# EAGLE design adcsd_shield (EAGLE 7.3.0)
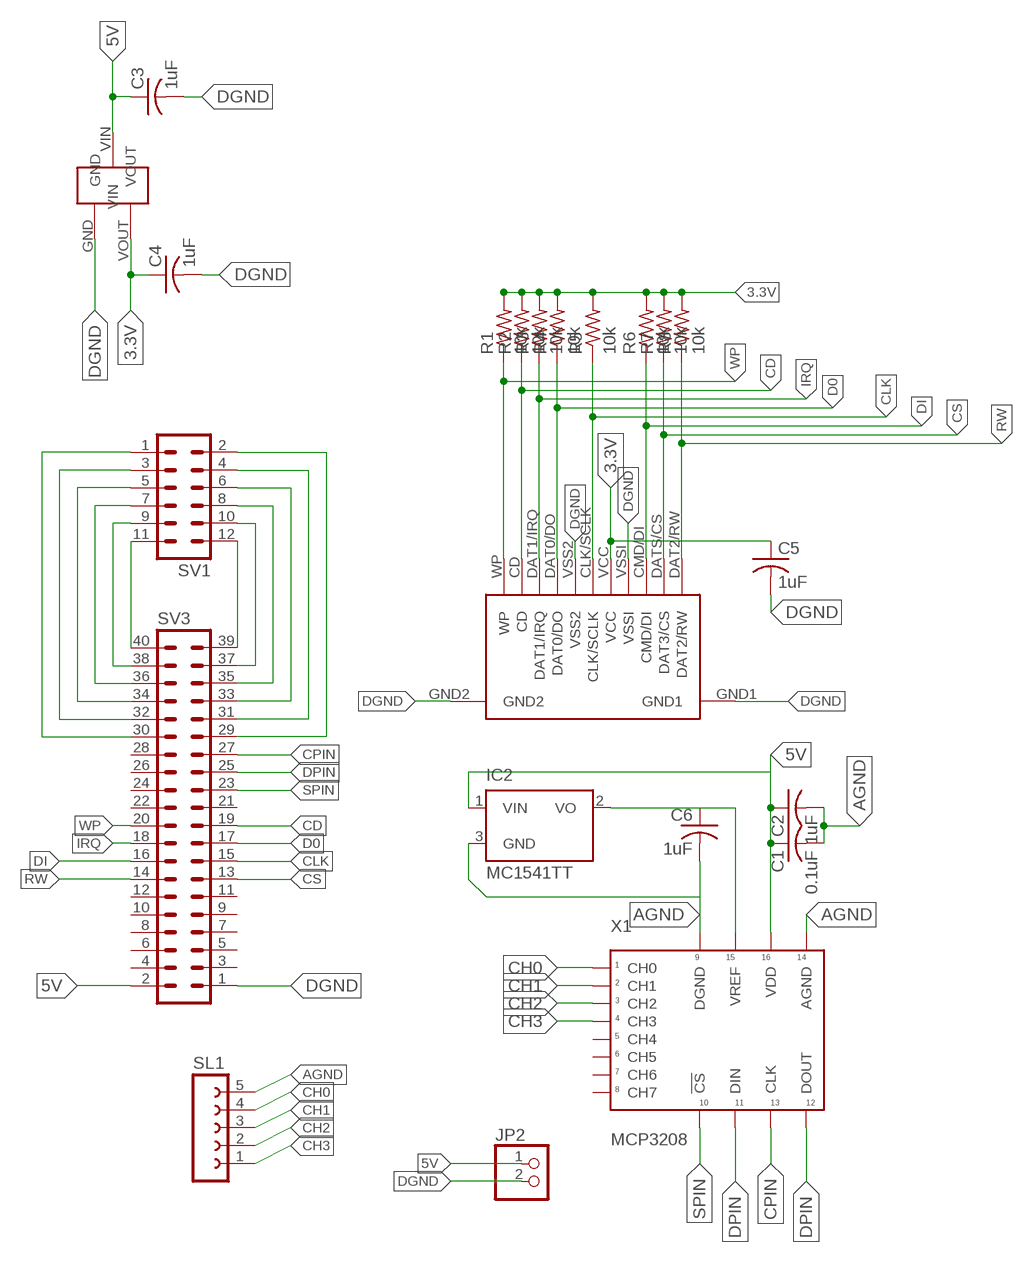
[diagram p0: schematic, sheet 1]

## Parts
C1  0.1uF  C-USC0402  [C0402]
C2  1uF  C-USC0402  [C0402]
C3  1uF  C-USC0402  [C0402]
C4  1uF  C-USC0402  [C0402]
C5  1uF  C-USC0402  [C0402]
C6  1uF  C-USC0402  [C0402]
IC2  MC1541TT  [SOT23]
JP2  PINHD-1X2  [1X02]
R1  10k  R-US_R0603  [R0603]
R2  10k  R-US_R0603  [R0603]
R3  10k  R-US_R0603  [R0603]
R4  10k  R-US_R0603  [R0603]
R5  10k  R-US_R0603  [R0603]
R6  10k  R-US_R0603  [R0603]
R7  10k  R-US_R0603  [R0603]
R8  10k  R-US_R0603  [R0603]
SL1  FE05-1  [FE05-1]
SV1  MA06-2  [MA06-2]
SV3  MA20-2  [MA20-2]
U$1  SD_1.0  [SD_1.0]
U$2  MCP1700T  [SOT23]
X1  MCP3208  21298EDIP  [DIP16]

## Nets
3.3V: C4.1 C5.1 R1.2 R2.2 R3.2 R4.2 R5.2 R6.2 R7.2 R8.2 U$1.VCC U$2.VOUT
5V: C1.1 C2.1 C3.1 IC2.1(VIN) JP2.1 SV3.2 U$2.VIN X1.P$16(VDD)
AGND: C1.2 C2.2 C6.2 IC2.3(GND) SL1.5 X1.P$9(DGND) X1.P$14(AGND)
CD: R2.1 SV3.19 U$1.CD
CH0: SL1.4 X1.P$1(CH0)
CH1: SL1.3 X1.P$2(CH1)
CH2: SL1.2 X1.P$3(CH2)
CH3: SL1.1 X1.P$4(CH3)
CLK: R5.1 SV3.15 U$1.CLK/SCLK
CPIN: SV3.27 X1.P$13(CLK)
CS: R7.1 SV3.13 U$1.DATS/CS(DAT3/CS)
D0: R4.1 SV3.17 U$1.DAT0/DO
DGND: C3.2 C4.2 C5.2 JP2.2 SV3.1 U$1.GND1 U$1.GND2 U$1.VSS2 U$1.VSSI U$2.GND
DI: R6.1 SV3.16 U$1.CMD/DI
DPIN: SV3.25 X1.P$11(DIN) X1.P$12(DOUT)
IRQ: R3.1 SV3.18 U$1.DAT1/IRQ
N$1: SV1.1 SV3.30
N$2: SV1.3 SV3.32
N$3: SV1.5 SV3.34
N$4: SV1.2 SV3.29
N$5: SV1.4 SV3.31
N$6: SV1.6 SV3.33
N$7: SV1.7 SV3.36
N$8: SV1.9 SV3.38
N$9: C6.1 IC2.2(VO) X1.P$15(VREF)
N$10: SV1.11 SV3.40
N$11: SV1.8 SV3.35
N$12: SV1.10 SV3.37
N$13: SV1.12 SV3.39
RW: R8.1 SV3.14 U$1.DAT2/RW
SPIN: SV3.23 X1.P$10(!CS)
WP: R1.1 SV3.20 U$1.WP
Unconnected: SV3.3 SV3.4 SV3.5 SV3.6 SV3.7 SV3.8 SV3.9 SV3.10 SV3.11 SV3.12 SV3.21 SV3.22 SV3.24 SV3.26 SV3.28 X1.P$5(CH4) X1.P$6(CH5) X1.P$7(CH6) X1.P$8(CH7)

## Library data of the parts
C1-C6 = rcl:C-US: CAPACITOR, American symbol
IC2 = microchip:MC15*: 2.5V and 4.096V Voltage References Source: http://www.microchip.com .. 21653b.pdf; OC_FARNELL: unknown; OC_NEWARK: unknown
JP2 = pinhead:PINHD-1X2: PIN HEADER
R1-R8 = rcl:R-US_: RESISTOR, American symbol
SL1 = con-lsta:FE05-1: FEMALE HEADER; OC_FARNELL: unknown; OC_NEWARK: unknown
SV1 = con-lstb:MA06-2: PIN HEADER; OC_FARNELL: unknown; OC_NEWARK: unknown
SV3 = con-lstb:MA20-2: PIN HEADER; OC_FARNELL: unknown; OC_NEWARK: unknown
U$1 = sd-1.0:SD_1.0
U$2 = mcp1700T:MCP1700T
X1 = Microchip1:21298E

## Board
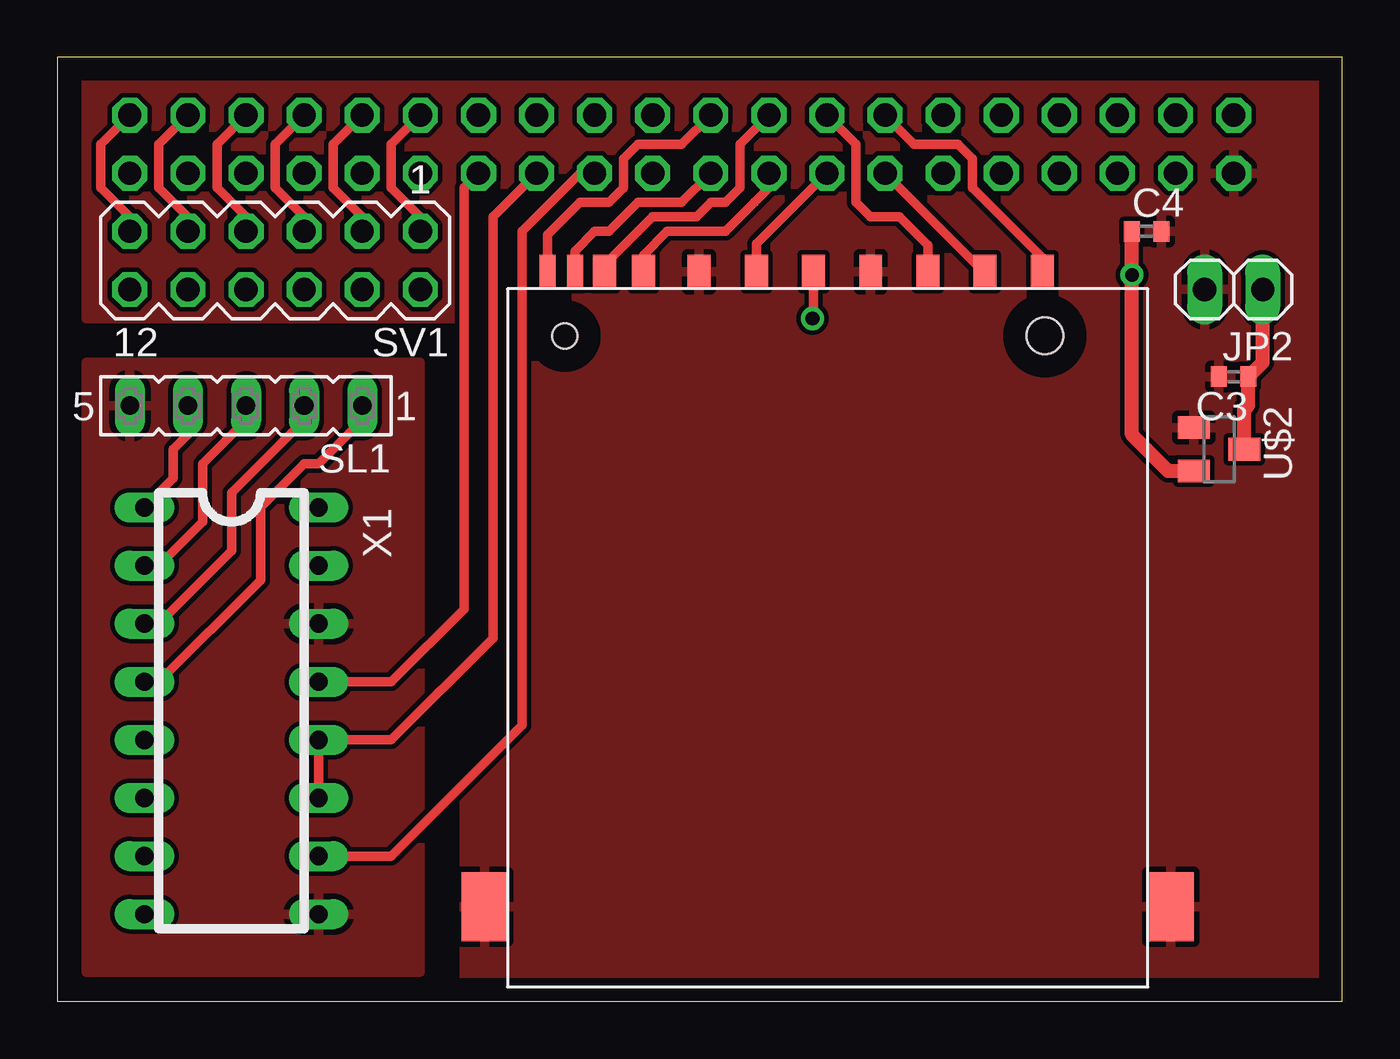
[diagram p1: board, top side]
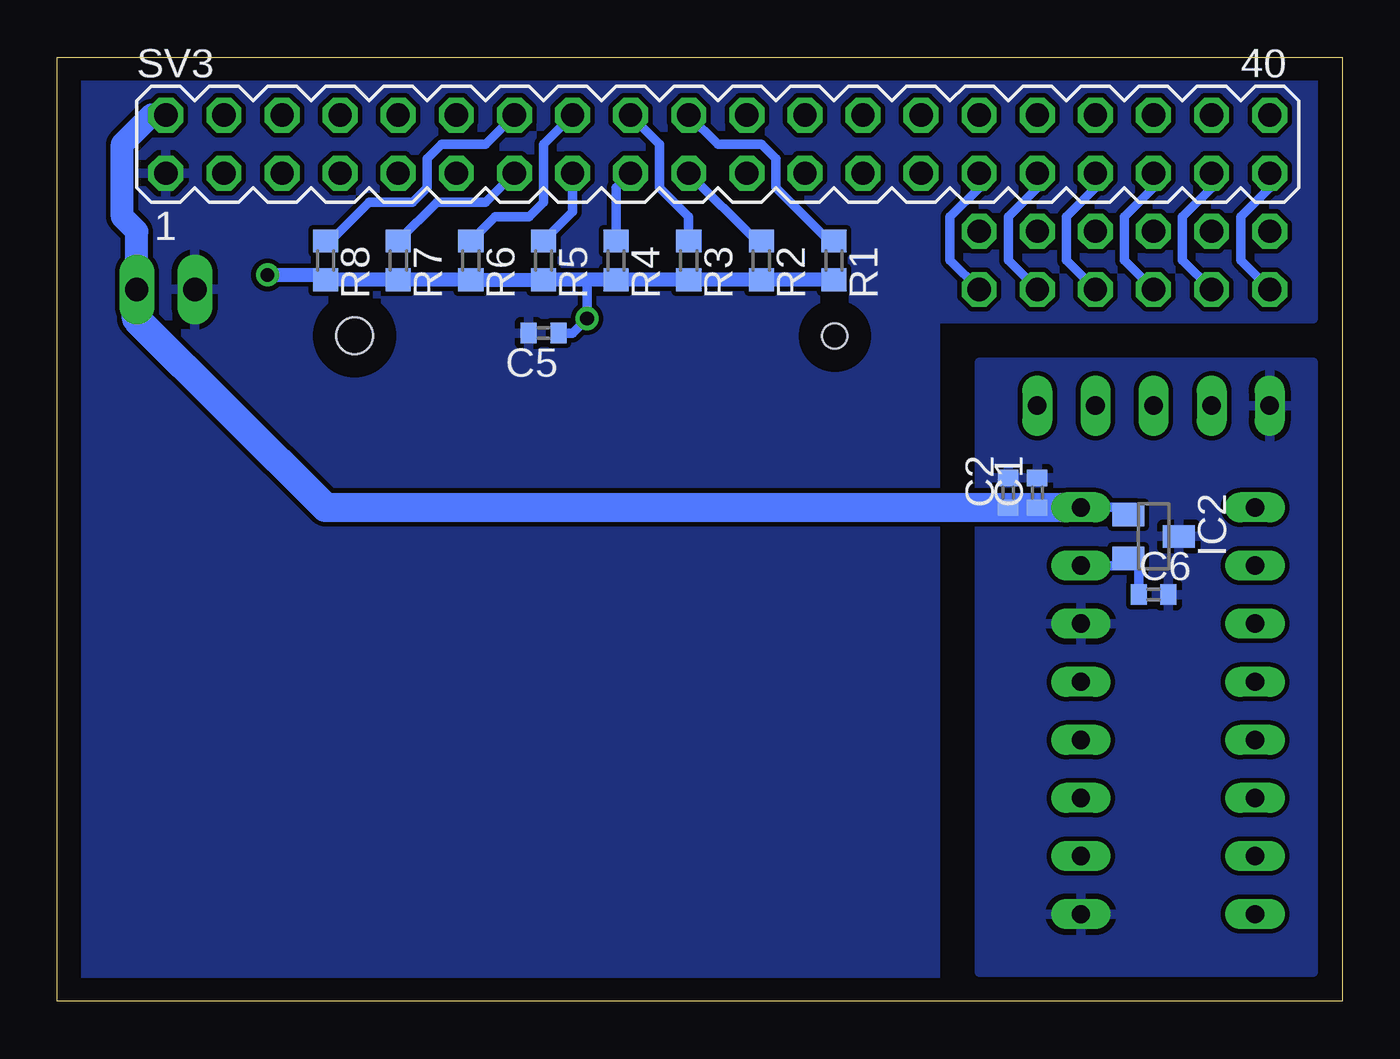
[diagram p2: board, bottom side, seen from below]

Size 56.19 x 41.27 mm. Coordinates in mm from the lower left corner, seen from the top.
Outline: 0,0 56.19,0 56.19,41.27 0,41.27 0,0
Copper layers (1*16): Top 0.035mm / dielectric 1.5mm / Bottom 0.035mm
Design rules "default *": minimum track width 10mil, minimum drill 14mil, track to track 8mil, track to pad 8mil, pad to pad 8mil, via to via 8mil, smd to smd 8mil, copper to edge 40mil, drill to drill 8mil, minimum pad ring 10mil, minimum via ring 8mil, stop-mask expansion 4mil, vias tented up to drill 0mil, thermal gap 10mil

### Footprints (pad centres in the part's own frame; a part is rotated, then mirrored left to right if it is on the bottom)
C0402 = smd 0.7 x 0.9: 1 -0.65,0; 2 0.65,0
SOT23 = smd 1 x 1.4: 1 -0.95,-1.1; 2 0.95,-1.1; 3 0,1.1
1X02 = drill 1.016 long: 1 -1.27,0; 2 1.27,0
R0603 = smd 1 x 1.1: 1 -0.85,0; 2 0.85,0
FE05-1 = drill 0.813 long: 1 -5.08,0; 2 -2.54,0; 3 0,0; 4 2.54,0; 5 5.08,0
MA06-2 = drill 1.016 octagon: 1 -6.35,-1.27; 2 -6.35,1.27; 3 -3.81,-1.27; 4 -3.81,1.27; 5 -1.27,-1.27; 6 -1.27,1.27; 7 1.27,-1.27; 8 1.27,1.27; 9 3.81,-1.27; 10 3.81,1.27; 11 6.35,-1.27; 12 6.35,1.27
MA20-2 = drill 1.016 octagon: 1 -24.13,-1.27; 2 -24.13,1.27; 3 -21.59,-1.27; 4 -21.59,1.27; 5 -19.05,-1.27; 6 -19.05,1.27; 7 -16.51,-1.27; 8 -16.51,1.27; 9 -13.97,-1.27; 10 -13.97,1.27; 11 -11.43,-1.27; 12 -11.43,1.27; 13 -8.89,-1.27; 14 -8.89,1.27; 15 -6.35,-1.27; 16 -6.35,1.27; 17 -3.81,-1.27; 18 -3.81,1.27; 19 -1.27,-1.27; 20 -1.27,1.27; 21 1.27,-1.27; 22 1.27,1.27; 23 3.81,-1.27; 24 3.81,1.27; 25 6.35,-1.27; 26 6.35,1.27; 27 8.89,-1.27; 28 8.89,1.27; 29 11.43,-1.27; 30 11.43,1.27; 31 13.97,-1.27; 32 13.97,1.27; 33 16.51,-1.27; 34 16.51,1.27; 35 19.05,-1.27; 36 19.05,1.27; 37 21.59,-1.27; 38 21.59,1.27; 39 24.13,-1.27; 40 24.13,1.27
SD_1.0 = smd 0.7 x 1.5: CD 2.95,31.25; WP 1.75,31.25 | smd 1 x 1.5: CLK/SCLK 10.88,31.25; CMD/DI 18.38,31.25; DAT0/DO 5.95,31.25; DAT1/IRQ 4.25,31.25; DAT2/RW 23.38,31.25; DATS/CS 20.88,31.25; VCC 13.38,31.25; VSS2 8.38,31.25; VSSI 15.88,31.25 | smd 2 x 3: GND1 29,3.5; GND2 -1,3.5 | hole 1.1: 2.5,28.45 | hole 1.6: 23.5,28.45
SOT23' = smd 1 x 1.4: GND -0.95,-1.1; VIN 0,1.1; VOUT 0.95,-1.1
DIP16 = drill 0.8 long: P$1 -10.16,-3.81; P$2 -7.62,-3.81; P$3 -5.08,-3.81; P$4 -2.54,-3.81; P$5 0,-3.81; P$6 2.54,-3.81; P$7 5.08,-3.81; P$8 7.62,-3.81; P$9 7.62,3.81; P$10 5.08,3.81; P$11 2.54,3.81; P$12 0,3.81; P$13 -2.54,3.81; P$14 -5.08,3.81; P$15 -7.62,3.81; P$16 -10.16,3.81

### Placement (x,y rotation side)
C1  13.34,22.23 90 bottom
C2  14.6,22.23 90 bottom
C3  51.44,27.3 180 top
C4  47.62,33.66 0 top
C5  34.92,29.21 180 bottom
C6  8.25,17.78 0 bottom
IC2  8.25,20.32 270 bottom
JP2  51.44,31.12 180 top
R1  22.22,32.38 270 bottom
R2  25.4,32.38 270 bottom
R3  28.58,32.38 270 bottom
R4  31.75,32.38 270 bottom
R5  34.92,32.38 270 bottom
R6  38.1,32.38 270 bottom
R7  41.27,32.38 270 bottom
R8  44.45,32.38 270 bottom
SL1  8.25,26.04 180 top
SV1  9.52,32.38 180 top
SV3  27.3,37.47 0 bottom
U$1  19.68,0.63 0 top
U$2  MCP1700T  [SOT23']  50.8,24.13 270 top
X1  7.62,11.43 270 top

### Tracks (layer width: path | path; a pad name or v marks a point on that pad's centre or on a via)
3.3V  (via drill 0.6)
  Top 0.406: U$1.VCC 33.06,29.89 v33.02,29.84
  Top 0.61: U$2.VOUT 48.58,23.18 46.99,24.77 v46.99,31.75 46.99,33.64 C4.1
  Bottom 0.406: 33.02,31.54 v33.02,29.84 33.66,29.21 C5.1
  Bottom 0.61: R1.2 R2.2 R3.2 R4.2 33.02,31.54 R5.2 R6.2 R7.2 R8.2 44.66,31.75 v46.99,31.75
5V
  Top 0.61: U$2.VIN 51.9,25.87 52.07,26.04 52.07,27.29 C3.1 52.7,27.93 JP2.1
  Bottom 0.406: X1.P$16 9.04,21.59 IC2.1
  Bottom 0.61: C2.1 C1.1 X1.P$16
  Bottom 1.016: JP2.1 52.7,33.66 53.34,34.29 53.34,37.47 52.07,38.73 SV3.2
  Bottom 1.27: JP2.1 52.72,31.1 52.72,29.84 44.45,21.59 X1.P$16
AGND
  pour Top: 1.27,1.27 1.27,27.94 15.88,27.94 15.88,1.27
  pour Bottom: 15.88,27.94 15.88,1.27 1.27,1.27 1.27,27.94
CD
  Top 0.406: U$1.CD 22.64,32.8 23.5,33.66 24.13,33.66 25.4,34.93 27.3,34.93 SV3.19
  Bottom 0.406: R2.1 25.61,33.23 SV3.19
CH0
  Top 0.406: SL1.4 5.71,24.77 5.08,24.13 5.08,22.86 X1.P$1
CH1
  Top 0.406: X1.P$2 4.45,19.05 6.35,20.95 6.35,23.5 8.25,25.4 SL1.3
CH2
  Top 0.406: X1.P$3 4.45,16.51 7.62,19.69 7.62,22.23 10.8,25.4 SL1.2
CH3
  Top 0.406: SL1.1 13.34,25.4 11.43,23.5 10.8,23.5 8.89,21.59 8.89,18.41 4.45,13.97 X1.P$4
CLK
  Top 0.406: U$1.CLK/SCLK 30.56,33.11 SV3.15
  Bottom 0.406: R5.1 33.66,34.51 SV3.15
CPIN
  Top 0.406: SV3.27 17.78,35.56 17.78,17.15 14.6,13.97 X1.P$13
CS
  Top 0.406: U$1.DATS/CS 40.56,31.83 SV3.13
  Bottom 0.406: R7.1 39.58,34.93 37.47,34.93 SV3.13
D0
  Top 0.406: U$1.DAT0/DO 25.64,32.62 26.67,33.66 29.21,33.66 30.48,34.93 31.11,35.56 SV3.17
  Bottom 0.406: R4.1 31.75,35.56 SV3.17
DGND
  pour Top: 17.78,0.63 17.78,29.84 1.27,29.84 1.27,40.64 55.25,40.64 55.25,0.63
  pour Bottom: 55.25,40.64 1.27,40.64 1.27,29.84 17.78,29.84 17.78,0.63 55.25,0.63
DI
  Top 0.406: U$1.CMD/DI 38.06,33.05 36.83,34.29 35.56,34.29 34.92,34.93 34.92,37.47 SV3.16
  Bottom 0.406: R6.1 37.05,34.29 35.56,34.29 34.92,34.93 34.92,37.47 SV3.16
DPIN
  Top 0.406: SV3.25 19.05,34.29 19.05,15.87 14.6,11.43 X1.P$12 X1.P$11
IRQ
  Top 0.406: U$1.DAT1/IRQ 23.94,32.19 25.4,33.66 26.03,34.29 27.94,34.29 28.58,34.93 29.21,34.93 29.84,35.56 29.84,37.47 SV3.18
  Bottom 0.406: R3.1 28.58,34.29 29.84,35.56 29.84,37.47 SV3.18
N$1
  Top 0.406: SV1.1 15.88,34.29 14.6,35.56 14.6,37.47 SV3.30
N$2
  Top 0.406: SV1.3 13.34,34.29 12.06,35.56 12.06,37.47 SV3.32
N$3
  Top 0.406: SV1.5 10.8,34.29 9.52,35.56 9.52,37.47 SV3.34
N$4
  Bottom 0.406: SV1.2 17.14,32.38 17.14,34.29 15.88,35.56 SV3.29
N$5
  Bottom 0.406: SV1.4 14.6,32.38 14.6,34.29 13.34,35.56 SV3.31
N$6
  Bottom 0.406: SV1.6 12.06,32.38 12.06,34.29 10.8,35.56 SV3.33
N$7
  Top 0.406: SV1.7 8.25,34.29 6.98,35.56 6.98,37.47 SV3.36
N$8
  Top 0.406: SV1.9 5.71,34.29 4.45,35.56 4.45,37.47 SV3.38
N$9
  Bottom 0.406: X1.P$15 9.04,19.05 | 9.04,19.05 IC2.2 | 9.04,19.05 8.91,18.91 C6.1
N$10
  Top 0.406: SV1.11 3.17,34.29 1.91,35.56 1.91,37.47 SV3.40
N$11
  Bottom 0.406: SV1.8 9.52,32.38 9.52,34.29 8.25,35.56 SV3.35
N$12
  Bottom 0.406: SV1.10 6.98,32.38 6.98,34.29 5.71,35.56 SV3.37
N$13
  Bottom 0.406: SV1.12 4.45,32.38 4.45,34.29 3.17,35.56 SV3.39
RW
  Top 0.406: U$1.DAT2/RW 43.06,32.5 40,35.56 40,36.83 39.37,37.47 37.47,37.47 SV3.14
  Bottom 0.406: SV3.14 37.47,37.47 39.37,37.47 40,36.83 40,35.56 40.64,34.93 42.55,34.93 44.23,33.23 R8.1
SPIN
  Top 0.406: SV3.23 22.86,36.2 20.32,33.66 20.32,12.06 14.6,6.35 X1.P$10
WP
  Top 0.406: U$1.WP 21.43,33.5 22.86,34.93 24.13,34.93 24.77,35.56 24.77,36.83 25.4,37.47 27.3,37.47 SV3.20
  Bottom 0.406: R1.1 22.44,33.23 24.77,35.56 24.77,36.83 25.4,37.47 27.3,37.47 SV3.20